# Altium schematic sheet RSD_M1_LED_TURN_LEFT_V2.SchDoc
size A4
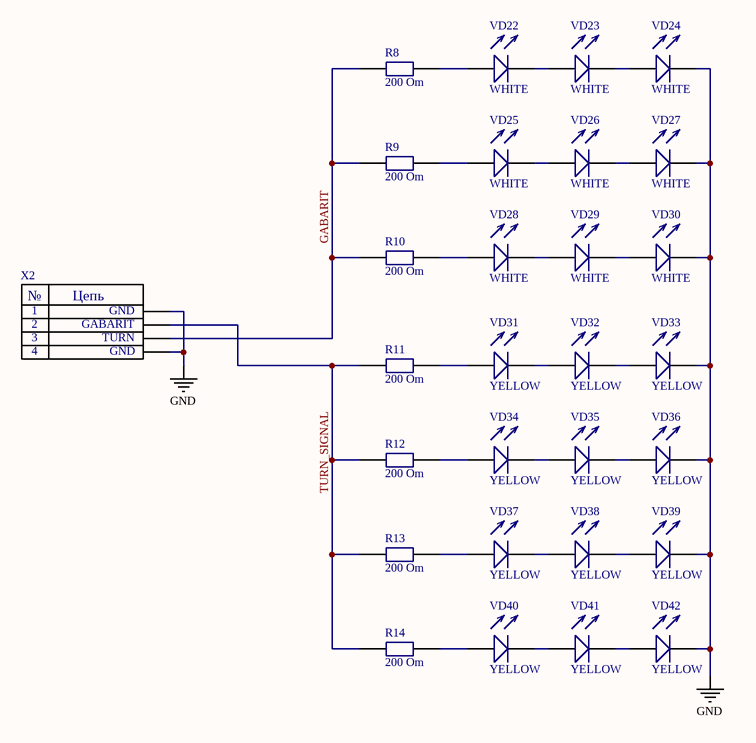
[diagram p0: RSD_M1_LED_TURN_LEFT_V2.SchDoc]

## Parts
R8  value 200 Om  [Res0603]  (hidden comment: Resistor)
R9  value 200 Om  [Res0603]  (hidden comment: Resistor)
R10  value 200 Om  [Res0603]  (hidden comment: Resistor)
R11  value 200 Om  [Res0603]  (hidden comment: Resistor)
R12  value 200 Om  [Res0603]  (hidden comment: Resistor)
R13  value 200 Om  [Res0603]  (hidden comment: Resistor)
R14  value 200 Om  [Res0603]  (hidden comment: Resistor)
VD22  value WHITE  [3528_LED]  (hidden comment: LED)
VD23  value WHITE  [3528_LED]  (hidden comment: LED)
VD24  value WHITE  [3528_LED]  (hidden comment: LED)
VD25  value WHITE  [3528_LED]  (hidden comment: LED)
VD26  value WHITE  [3528_LED]  (hidden comment: LED)
VD27  value WHITE  [3528_LED]  (hidden comment: LED)
VD28  value WHITE  [3528_LED]  (hidden comment: LED)
VD29  value WHITE  [3528_LED]  (hidden comment: LED)
VD30  value WHITE  [3528_LED]  (hidden comment: LED)
VD31  value YELLOW  [3528_LED]  (hidden comment: LED)
VD32  value YELLOW  [3528_LED]  (hidden comment: LED)
VD33  value YELLOW  [3528_LED]  (hidden comment: LED)
VD34  value YELLOW  [3528_LED]  (hidden comment: LED)
VD35  value YELLOW  [3528_LED]  (hidden comment: LED)
VD36  value YELLOW  [3528_LED]  (hidden comment: LED)
VD37  value YELLOW  [3528_LED]  (hidden comment: LED)
VD38  value YELLOW  [3528_LED]  (hidden comment: LED)
VD39  value YELLOW  [3528_LED]  (hidden comment: LED)
VD40  value YELLOW  [3528_LED]  (hidden comment: LED)
VD41  value YELLOW  [3528_LED]  (hidden comment: LED)
VD42  value YELLOW  [3528_LED]  (hidden comment: LED)
X2  1: GND  2: GABARIT  3: TURN  [FPC_4_1]  (hidden comment: FPC_connector_4_1)

## Nets
GND: VD24.1 VD27.1 VD30.1 VD33.1 VD36.1 VD39.1 VD42.1 X2.1 X2.4
GABARIT: R8.2 R9.2 R10.2 X2.3
TURN_SIGNAL: R11.2 R12.2 R13.2 R14.2 X2.2
NetR8_1: R8.1 VD22.2
NetR9_1: R9.1 VD25.2
NetR10_1: R10.1 VD28.2
NetR11_1: R11.1 VD31.2
NetR12_1: R12.1 VD34.2
NetR13_1: R13.1 VD37.2
NetR14_1: R14.1 VD40.2
NetVD22_1: VD22.1 VD23.2
NetVD23_1: VD23.1 VD24.2
NetVD25_1: VD25.1 VD26.2
NetVD26_1: VD26.1 VD27.2
NetVD28_1: VD28.1 VD29.2
NetVD29_1: VD29.1 VD30.2
NetVD31_1: VD31.1 VD32.2
NetVD32_1: VD32.1 VD33.2
NetVD34_1: VD34.1 VD35.2
NetVD35_1: VD35.1 VD36.2
NetVD37_1: VD37.1 VD38.2
NetVD38_1: VD38.1 VD39.2
NetVD40_1: VD40.1 VD41.2
NetVD41_1: VD41.1 VD42.2

## Notes on the sheet
- (in symbol FPC_connector_4_1) №; Цепь

## Library data of the parts
X2 = FPC_connector_4_1: Value: 0522070433; 4: GND